# Altium schematic sheet IPMI.SchDoc
size A4; DocumentNumber: 5; SheetNumber: 5; SheetTotal: 30
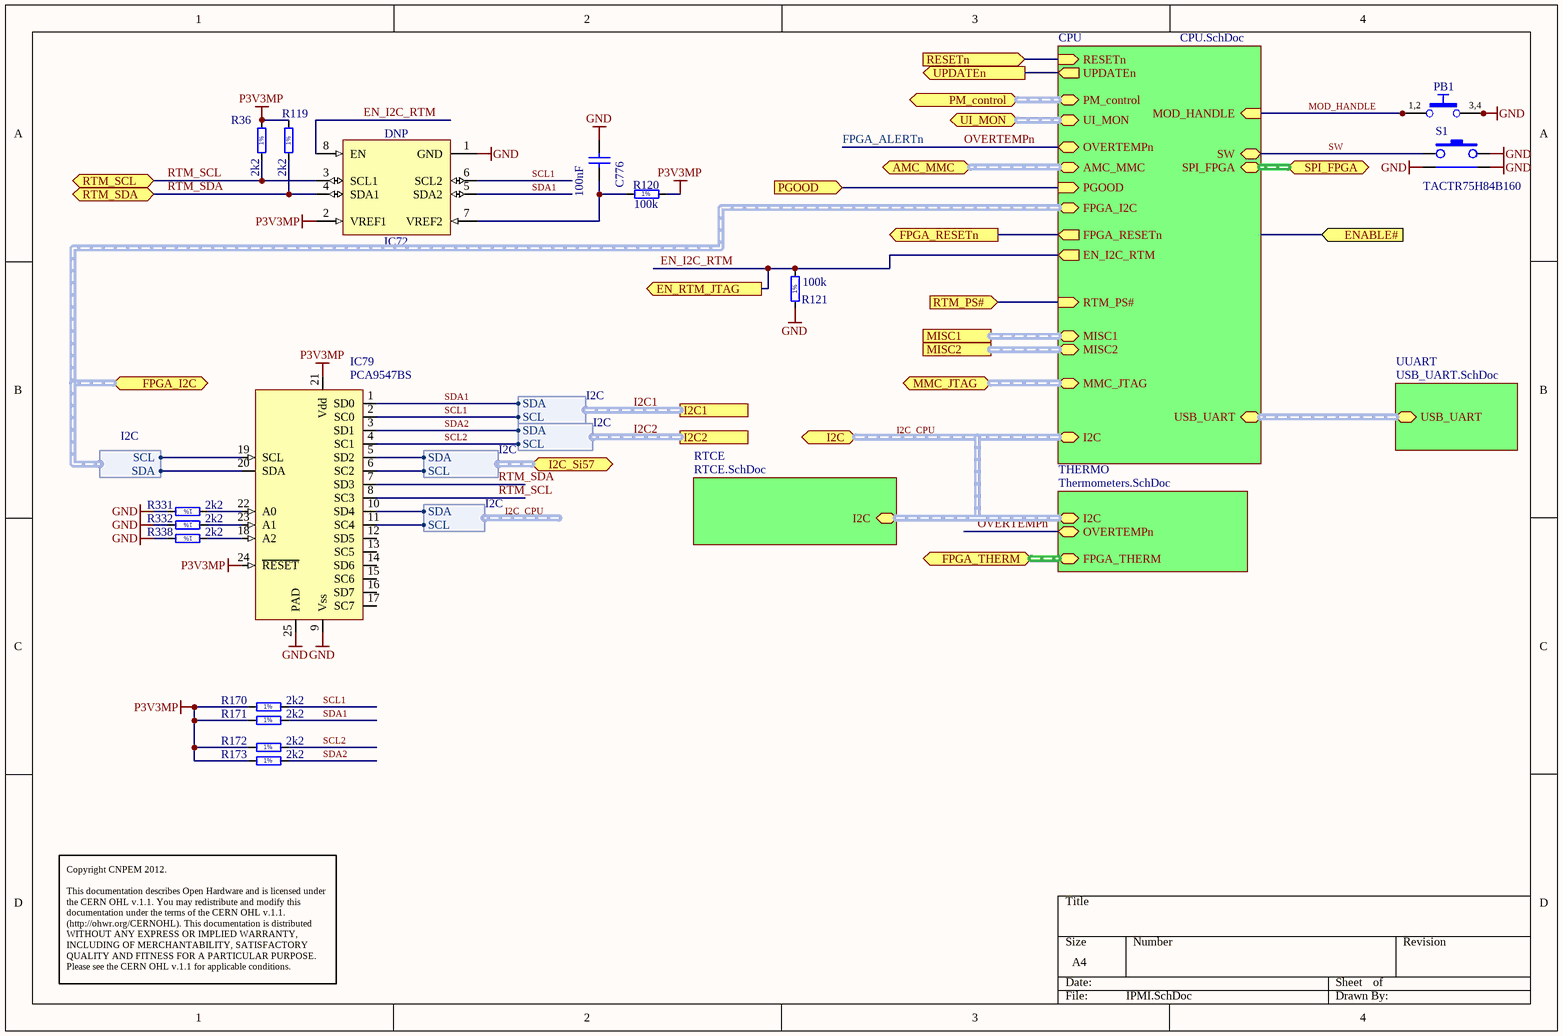
[diagram p0: IPMI.SchDoc]

## Parts
C776  100nF  [CAPC0603X33N]
IC72  DNP  [SOP65P400X130-8N]
IC79  PCA9547BS  [HVQFN24]
PB1  Push Button  [SW_C&K_HDT0001]  (value not drawn)
R36  2k2  [RESC1005X40N]
R119  2k2  [RESC1005X40N]
R120  100k  [RESC1005X40N]
R121  100k  [RESC1005X40N]
R170  2k2  [RESC1005X40N]
R171  2k2  [RESC1005X40N]
R172  2k2  [RESC1005X40N]
R173  2k2  [RESC1005X40N]
R331  2k2  [RESC1005X40N]
R332  2k2  [RESC1005X40N]
R338  2k2  [RESC1005X40N]
S1  TACTR75H84B160  [PB_ALPS_SKHHLQA010]

## Sub-sheets
CPU = CPU.SchDoc: PM_control (harness PM_control), OVERTEMPn (bidir), MOD_HANDLE (in), SPI_FPGA (harness SPI), SW, RESETn (in), UPDATEn (out), I2C (harness I2C), MISC1 (harness MISC), MISC2 (harness MISC), FPGA_RESETn (out), RTM_PS# (in), EN_I2C_RTM (out), FPGA_I2C (harness I2C), MMC_JTAG (harness MMC_JTAG), USB_UART (harness USB_UART), AMC_MMC (harness AMC_MMC), UI_MON (harness UI_MON), PGOOD (in)
RTCE = RTCE.SchDoc: I2C (harness I2C)
THERMO = Thermometers.SchDoc: OVERTEMPn (bidir), FPGA_THERM (harness FPGA_THERM), I2C (harness I2C)
UUART = USB_UART.SchDoc: USB_UART (harness USB_UART)

## Ports
AMC_MMC (harness AMC_MMC), EN_RTM_JTAG (out), ENABLE# (in), FPGA_I2C (harness I2C), FPGA_RESETn (out), FPGA_THERM (harness FPGA_THERM), I2C1 (harness I2C), I2C2 (harness I2C), I2C (harness I2C), I2C_Si57 (harness I2C), MISC1 (harness MISC), MISC2 (harness MISC), MMC_JTAG, PGOOD (in), PM_control (harness PM_control), RESETn (in), RTM_PS# (in), RTM_SCL (bidir), RTM_SDA (bidir), SPI_FPGA (harness SPI), UI_MON, UPDATEn (out)

## Harnesses
I2C: SCL, SDA

## Nets
GND: C776.2 IC72.1(GND) IC79.9(Vss) IC79.25(PAD) PB1.3 PB1.4 R121.1 R331.2 R332.2 R338.2 S1.2 S1.3 S1.4
P3V3MP: IC72.2(VREF1) IC79.21(Vdd) IC79.24(~{RESET}) R36.2 R119.2 R120.2 R170.1 R171.1 R172.1 R173.1
EN_I2C_RTM: IC72.8(EN) R121.2 ; port EN_RTM_JTAG, sheet CPU/EN_I2C_RTM
FPGA_ALERTn: sheet CPU/OVERTEMPn, sheet THERMO/OVERTEMPn  [also labelled OVERTEMPn]
FPGA_RESETn: port FPGA_RESETn, sheet CPU/FPGA_RESETn
I2C_CPU.SCL: IC79.11(SC4) ; port I2C.SCL
I2C_CPU.SDA: IC79.10(SD4) ; port I2C.SDA
MOD_HANDLE: PB1.1 PB1.2 ; sheet CPU/MOD_HANDLE
PGOOD: port PGOOD, sheet CPU/PGOOD
RESETn: port RESETn, sheet CPU/RESETn
RTM_PS#: port RTM_PS#, sheet CPU/RTM_PS#
RTM_SCL: IC72.3(SCL1) IC79.8(SC3) R36.1 ; port RTM_SCL
RTM_SDA: IC72.4(SDA1) IC79.7(SD3) R119.1 ; port RTM_SDA
SCL1: IC72.6(SCL2) IC79.2(SC0) R170.2 ; port I2C1.SCL  [project net I2C1.SCL]
SCL2: IC79.4(SC1) R172.2 ; port I2C2.SCL  [project net I2C2.SCL]
SDA1: IC72.5(SDA2) IC79.1(SD0) R171.2 ; port I2C1.SDA  [project net I2C1.SDA]
SDA2: IC79.3(SD1) R173.2 ; port I2C2.SDA  [project net I2C2.SDA]
SW: S1.1 ; sheet CPU/SW
UPDATEn: port UPDATEn, sheet CPU/UPDATEn
NetC776_1: C776.1 IC72.7(VREF2) R120.1
NetIC79_5: IC79.5(SD2) ; port I2C_Si57.SDA
NetIC79_6: IC79.6(SC2) ; port I2C_Si57.SCL
NetIC79_18: IC79.18(A2) R338.1
NetIC79_19: IC79.19(SCL) ; port FPGA_I2C.SCL
NetIC79_20: IC79.20(SDA) ; port FPGA_I2C.SDA
NetIC79_22: IC79.22(A0) R331.1
NetIC79_23: IC79.23(A1) R332.1

Not connected (* = marked no-connect by the designer): IC79 12(SD5) 13(SC5) 14(SD6) 15(SC6) 16(SD7) 17(SC7)

## Buses and harness runs
harness I2C1 = port I2C1
harness I2C2 = port I2C2
harness I2C_CPU = port I2C = sheet CPU/I2C = sheet RTCE/I2C = sheet THERMO/I2C
harness port AMC_MMC = sheet CPU/AMC_MMC
harness port FPGA_I2C = sheet CPU/FPGA_I2C
harness port FPGA_THERM = sheet THERMO/FPGA_THERM
harness port MISC1 = sheet CPU/MISC1
harness port MISC2 = sheet CPU/MISC2
harness port MMC_JTAG = sheet CPU/MMC_JTAG
harness port PM_control = sheet CPU/PM_control
harness port SPI_FPGA = sheet CPU/SPI_FPGA
harness port UI_MON = sheet CPU/UI_MON
harness sheet CPU/USB_UART = sheet UUART/USB_UART

## Notes on the sheet
- Copyright CNPEM 2012.
  This documentation describes Open Hardware and is licensed under the CERN OHL v.1.1. You may redistribute and modify this documentation under the terms of the CERN OHL v.1.1. (http://ohwr.org/CERNOHL). This documentation is distributed WITHOUT ANY EXPRESS OR IMPLIED WARRANTY, INCLUDING OF MERCHANTABILITY, SATISFACTORY QUALITY AND FITNESS FOR A PARTICULAR PURPOSE. Please see the CERN OHL v.1.1 for applicable conditions.
- (in symbol R0402_2K2_1%_0.0625W_100PPM) 1%
- (in symbol R0402_100K_1%_0.0625W_100PPM) 1%
- (in symbol SW_C&K_HDT0001) 1,2; 3,4

## Library data of the parts
C776 = CC0201_100NF_6.3V_10%_X5R: Non-polarised capacitor; Part Description: SMD Multilayer Chip Ceramic Capacitor; Manufacturer: GENERIC; Manufacturer1 Part Number: 02016D104KAT2A; Voltage: 6.3V; TC: X5R; Tolerance: ±10%; Table: Capacitors SMD; Part Number: CC0201_100NF_6.3V_10%_X5R; Component Kind: Standard; Component Type: Standard; Pin Count: 2; Value: 100nF; Status: Not Recommended; Manufacturer Part Number: CC0201_100NF_6.3V_10%_X5R; Case: 0201; Mounted: Yes; Socket: No; SMD: Yes; Manufacturer1 Example: AVX; Manufacturer1 ComponentHeight: 0.33mm; HelpURL: \\cern.ch\dfs\Applications\Altium\Datasheets\CC0201_X5R_AVX.pdf; Author: CERN DEM JLC; CreateDate: 2007-12-03; LatestRevisionDate: 2007-12-03
IC72 = PCA9306DCTR: Dual Bidirectional I2C Bus And SMBus Voltage-Level Translator; Manufacturer: TEXAS INSTRUMENTS; Table: Analog & Interface; Part Number: PCA9306DCTR; Component Kind: Standard; Component Type: Standard; Device: PCA9306DCTR; PackageDescription: SOP, 0.65mm, Pitch; 8 Pin, 2.80mm W X 2.95mm L X 1.30mm H Body, PC Medium Density; Part Description: Dual Bidirectional I2C Bus And SMBus Voltage-Level Translator; Manufacturer Part Number: PCA9306DCTR; Pin Count: 8; Case: SSOP8; Mounted: Yes; Socket: No; SMD: Yes; ComponentHeight: 1.3mm; Author: CERN DEM JLC; HelpURL: \\cern.ch\dfs\Applications\Altium\Datasheets\PCA9306DCTR.pdf; CreateDate: 2013-02-25; LatestRevisionDate: 2013-02-25
IC79 = IIC_MUX_PCA9547: 8-channel I2C-bus multiplexer with reset
PB1 = SW_C&K_HDT0001: Push-Button Switch SPDT; Part Description: 5VDC 1mA SPST-NO Micro Mini Surface Surface Mount Detect Push-Button Switch, HDT Serie; Manufacturer: C&K; Table: Switches; Part Number: SW_C&K_HDT0001; Component Kind: Standard; Component Type: Standard; Pin Count: 4; PackageDescription: Body 3.5x2.8mm, Micro Mini Surface Mount Detect Switches, HDT Serie; Family: Push Button; Mounted: Yes; Socket: No; SMD: Yes; Status: None; Manufacturer Part Number: HDT0001; ComponentHeight: 3.35mm; HelpURL: \\cern.ch\dfs\Applications\Altium\Datasheets\SW_C&K_HDT0001.pdf; Author: CERN DEM JLC; CreateDate: 2012-08-15; LatestRevisionDate: 2012-08-15
R36 R119 R170-R173 R331 R332 R338 = R0402_2K2_1%_0.0625W_100PPM: Resistor - 1%; Part Description: General Purpose Thick Film Chip Resistor; Manufacturer: GENERIC; Manufacturer1 Part Number: 232270672202L; TC: ±100ppm/°C; Table: Resistors SMD; Part Number: R0402_2K2_1%_0.0625W_100PPM; Component Kind: Standard; Component Type: Standard; Pin Count: 2; Value: 2k2; Status: Not recommended; Power: 0.0625W; Tolerance: ±1%; Manufacturer Part Number: R0402_2K2_1%_0.0625W_100PPM; Case: 0402; Mounted: Yes; Socket: No; SMD: Yes; Manufacturer1 Example: YAGEO PHYCOMP; Manufacturer1 ComponentHeight: 0.4mm; HelpURL: \\cern.ch\dfs\Applications\Altium\Datasheets\R0402_Phycomp_RC0402.pdf; Author: CERN DEM JLC; CreateDate: 2007-12-03; LatestRevisionDate: 2012-10-17
R120 R121 = R0402_100K_1%_0.0625W_100PPM: Resistor - 1%; Part Description: General Purpose Thick Film Chip Resistor; Manufacturer: GENERIC; Manufacturer1 Part Number: 232270671004L; TC: ±100ppm/°C; Table: Resistors SMD; Part Number: R0402_100K_1%_0.0625W_100PPM; Component Kind: Standard; Component Type: Standard; Pin Count: 2; Value: 100k; Status: Not recommended; Power: 0.0625W; Tolerance: ±1%; Manufacturer Part Number: R0402_100K_1%_0.0625W_100PPM; Case: 0402; Mounted: Yes; Socket: No; SMD: Yes; Manufacturer1 Example: YAGEO PHYCOMP; Manufacturer1 ComponentHeight: 0.4mm; HelpURL: \\cern.ch\dfs\Applications\Altium\Datasheets\R0402_Phycomp_RC0402.pdf; Author: CERN DEM JLC; CreateDate: 2007-12-03; LatestRevisionDate: 2012-10-17
S1 = SW-PB_RA_5.8mm: Push button